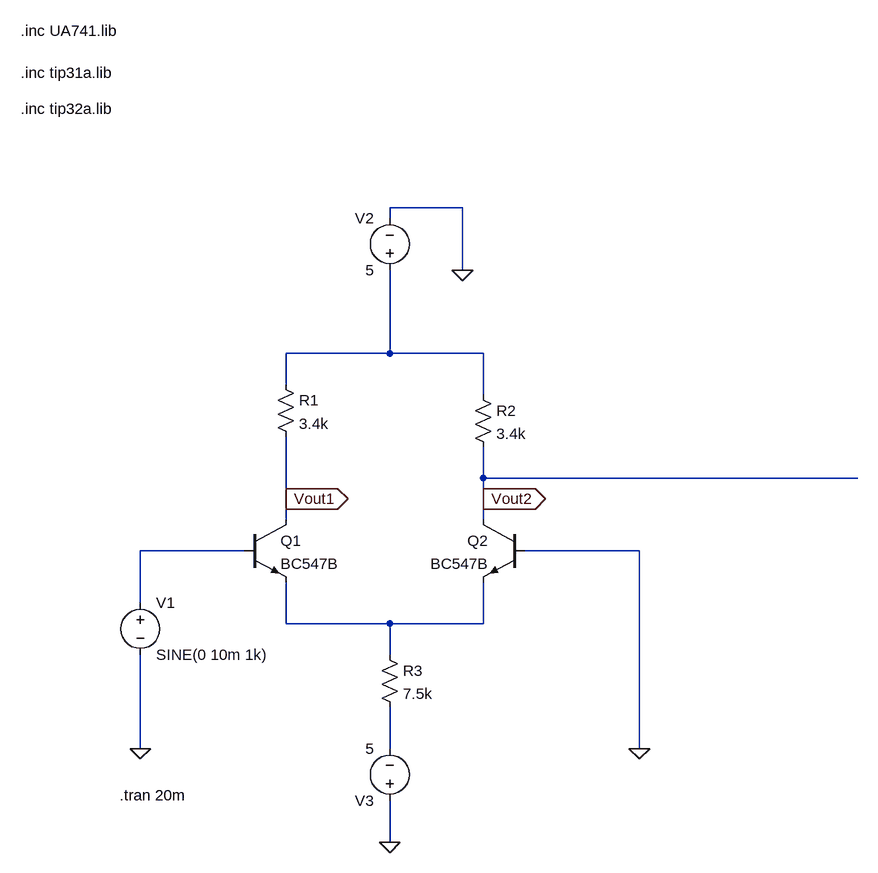
[diagram p0: schematic 1st-stage(pre_amp).asc]
1st-stage(pre_amp).asc, the LTspice schematic file:
Version 4.1
SHEET 1 2260 1028
WIRE -1296 32 -1408 32
WIRE -1408 48 -1408 32
WIRE -1296 128 -1296 32
WIRE -1408 256 -1408 128
WIRE -1408 256 -1568 256
WIRE -1264 256 -1408 256
WIRE -1568 304 -1568 256
WIRE -1264 320 -1264 256
WIRE -1264 448 -1264 400
WIRE -688 448 -1264 448
WIRE -1568 480 -1568 384
WIRE -1264 480 -1264 448
WIRE -1568 512 -1568 480
WIRE -1264 512 -1264 480
WIRE -1632 560 -1792 560
WIRE -1024 560 -1200 560
WIRE -1792 640 -1792 560
WIRE -1568 672 -1568 608
WIRE -1408 672 -1568 672
WIRE -1264 672 -1264 608
WIRE -1264 672 -1408 672
WIRE -1408 720 -1408 672
WIRE -1792 864 -1792 720
WIRE -1408 864 -1408 800
WIRE -1024 864 -1024 560
WIRE -1408 1008 -1408 944
FLAG -1792 864 0
FLAG -1024 864 0
FLAG -1296 128 0
FLAG -1568 480 Vout1
IOPIN -1568 480 Out
FLAG -1264 480 Vout2
IOPIN -1264 480 Out
FLAG -1408 1008 0
SYMBOL npn -1632 512 R0
SYMATTR InstName Q1
SYMATTR Value BC547B
SYMBOL res -1584 288 R0
SYMATTR InstName R1
SYMATTR Value 3.4k
SYMBOL res -1280 304 R0
SYMATTR InstName R2
SYMATTR Value 3.4k
SYMBOL res -1424 704 R0
SYMATTR InstName R3
SYMATTR Value 7.5k
SYMBOL voltage -1792 624 R0
WINDOW 123 0 0 Left 0
WINDOW 39 0 0 Left 0
SYMATTR InstName V1
SYMATTR Value SINE(0 10m 1k)
SYMBOL voltage -1408 144 R180
WINDOW 0 24 96 Left 2
WINDOW 3 24 16 Left 2
WINDOW 123 0 0 Left 0
WINDOW 39 0 0 Left 0
SYMATTR InstName V2
SYMATTR Value 5
SYMBOL voltage -1408 960 R180
WINDOW 123 0 0 Left 0
WINDOW 39 0 0 Left 0
SYMATTR InstName V3
SYMATTR Value 5
SYMBOL npn -1200 512 M0
SYMATTR InstName Q2
SYMATTR Value BC547B
TEXT -1824 936 Left 2 !.tran 20m
TEXT -1976 -240 Left 2 !.inc UA741.lib
TEXT -1976 -176 Left 2 !.inc tip31a.lib
TEXT -1976 -120 Left 2 !.inc tip32a.lib

The netlist it stands for:
* 1st-stage(pre_amp).asc
Q1 Vout1 N002 N003 0 BC547B
R1 N001 Vout1 3.4k
R2 N001 Vout2 3.4k
R3 N003 N004 7.5k
V1 N002 0 SINE(0 10m 1k)
V2 N001 0 5
V3 0 N004 5
Q2 Vout2 0 N003 0 BC547B
.model NPN NPN
.model PNP PNP
.lib standard.bjt
.tran 20m
.inc UA741.lib
.inc tip31a.lib
.inc tip32a.lib
.backanno
.end